# EAGLE design schematics (EAGLE 9.4.2)
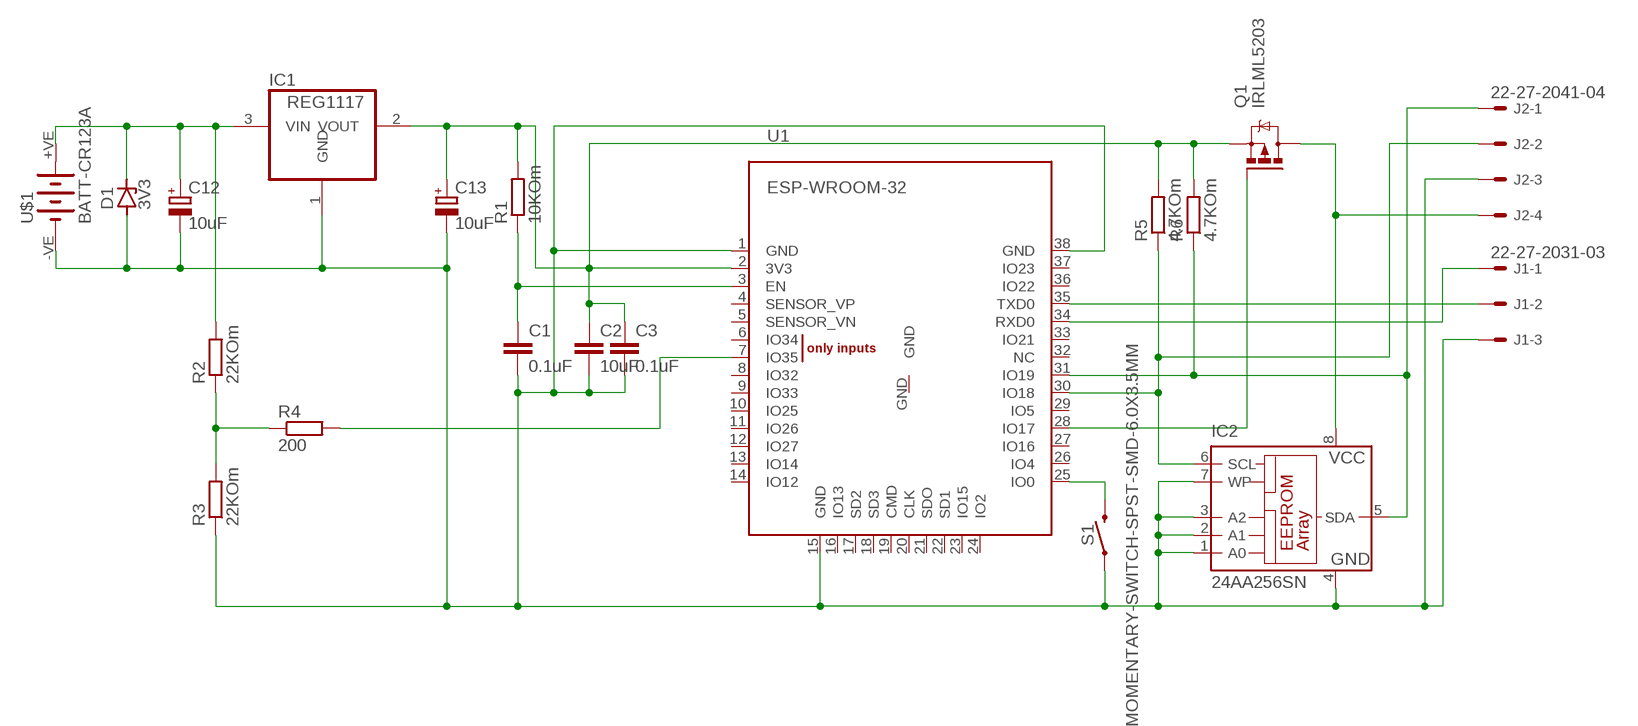
[diagram p0: schematic, sheet 1]

## Parts
C1  0.1uF  C-EUC1206K  [C1206K]
C2  10uF  C-EUC1206K  [C1206K]
C3  0.1uF  C-EUC1206K  [C1206K]
C12  10uF  CPOL-EUSMCE  [SMC_E]
C13  10uF  CPOL-EUSMCE  [SMC_E]
D1  3V3  ZENER-DIODESOT223  [SOT223]
IC1  REG1117  [SOT223]
IC2  24AA256SN  [SO-08]
J1  22-27-2031-03  [6410-03]
J2  22-27-2041-04  [6410-04]
Q1  IRLML5203  [MICRO3]
R1  10KOm  R-EU_R1206  [R1206]
R2  22KOm  R-EU_R1206  [R1206]
R3  22KOm  R-EU_R1206  [R1206]
R4  200  R-EU_R1206  [R1206]
R5  4.7KOm  R-EU_R1206  [R1206]
R6  4.7KOm  R-EU_R1206  [R1206]
S1  MOMENTARY-SWITCH-SPST-SMD-6.0X3.5MM  [TACTILE_SWITCH_SMD_6.0X3.5MM]
U1  ESP-WROOM-32  [ESP-WROOM-32]
U$1  BATT-CR123A  [KEYSTONE-2/3A]

## Nets
N$2: C12.+ D1.4(C) IC1.3(VIN) R2.2 U$1.+VE(+)
N$3: S1.2 U1.25(IO0)
N$4: R2.1 R3.2 R4.1
N$5: C1.2 C2.2 C3.2 C12.- C13.- D1.1(A) IC1.1(GND) IC2.1(A0) IC2.2(A1) IC2.3(A2) IC2.4(GND) IC2.7(WP) J1.3 J2.3 R3.1 S1.1 U1.1(GND) U1.15(GND) U1.38(GND) U$1.-VE(-)
N$6: C1.1 R1.1 U1.3(EN)
N$7: J1.2 U1.35(TXD0)
N$8: C2.1 C3.1 C13.+ IC1.2(VOUT) Q1.2(S) R1.2 R5.2 R6.2 U1.2(3V3)
N$9: R4.2 U1.7(IO35)
N$10: J1.1 U1.34(RXD0)
N$11: IC2.6(SCL) J2.2 R5.1 U1.30(IO18)
N$12: IC2.5(SDA) J2.1 R6.1 U1.31(IO19)
N$13: Q1.1(G) U1.28(IO17)
N$16: IC2.8(VCC) J2.4 Q1.3(D)
Unconnected: U1.4(SENSOR_VP) U1.5(SENSOR_VN) U1.6(IO34) U1.8(IO32) U1.9(IO33) U1.10(IO25) U1.11(IO26) U1.12(IO27) U1.13(IO14) U1.14(IO12) U1.16(IO13) U1.17(SD2) U1.18(SD3) U1.19(CMD) U1.20(CLK) U1.21(SDO) U1.22(SD1) U1.23(IO15) U1.24(IO2) U1.26(IO4) U1.27(IO16) U1.29(IO5) U1.32(NC) U1.33(IO21) U1.36(IO22) U1.37(IO23) U1.GND

## Library data of the parts
C1-C3 = rcl:C-EU: CAPACITOR, European symbol; SPICEPREFIX: C
C12 C13 = rcl:CPOL-EU: POLARIZED CAPACITOR, European symbol; SPICEPREFIX: C
D1 = diode:ZENER-DIODE: Z-Diode
IC1 = burr-brown:REG1117: 800mA and 1A Low Dropout (LDO) Positive Regulator 1.8V, 2.5V, 2.85V, 3.3V, 5V, and Adj; MPN: REG1117; OC_FARNELL: 1097566; OC_NEWARK: 14P6981
IC2 = microchip:24*: Serial EEPROM I2C; MPN: 24AA256T-I/SM; OC_FARNELL: 1579570; OC_NEWARK: 08N6838
J1 = con-molex:22-?-03: CONNECTOR wire to board 2.54 mm (.1 inch) pitch header; MF: MOLEX; OC_FARNELL: unknown; OC_NEWARK: unknown
J2 = con-molex:22-?-04: CONNECTOR wire to board 2.54 mm (.1 inch) pitch header; MF: MOLEX; OC_FARNELL: unknown; OC_NEWARK: unknown
Q1 = transistor-power:IRLML5203: HEXFET P-Channel Power MOSFET
R1-R6 = rcl:R-EU_: RESISTOR, European symbol; SPICEPREFIX: R
S1 = SparkFun-Switches:MOMENTARY-SWITCH-SPST: Momentary Switch (Pushbutton) - SPST Normally-open (NO) SPST momentary switches (buttons, pushbuttons). Variants PTH-12MM - 12mm square, through-hole Momentary Pushbutton Switch - 12mm Square <https://www.sparkfun.com/products/9190> (COM-09190) PTH-6.0MM, PTH-6.0MM-KIT - 6.0mm square, through-hole Mini Pushbutton Switch <https://www.sparkfun.com/products/97> (COM-00097) KIT package intended for soldering kit's - only one side of pads' copper is exposed. PTH-RIGHT-ANGLE-KIT - Right-angle, through-hole Right Angle Tactile Button <https://www.sparkfun.com/products/10791> - Used on SparkFun BigTime Watch Kit <https://www.sparkfun.com/products/11734> SMD-12MM - 12mm square, surface-mount Tactile Button - SMD (12mm) <https://www.sparkfun.com/products/12993> (COM-12993) Used on SparkFun PicoBoard <https://www.sparkfun.com/products/11888> SMD-4.5MM - 4.5mm Square Trackball Switch Used on SparkFun Blackberry Trackballer Breakout <https://www.sparkfun.com/products/13169> SMD-4.6MMX2.8MM - 4.60mm x 2.80mm, surface mount Used on SparkFun SAMD21 Mini Breakout <https://www.sparkfun.com/products/13664> SMD-5.2MM, SMD-5.2-REDUNDANT - 5.2mm square, surface-mount Mini Pushbutton Switch - SMD <https://www.sparkfun.com/products/8720> (COM-08720) Used on Arduino Pro Mini <https://www.sparkfun.com/products/11114> REDUNDANT package connects both switch circuits together SMD-6.0X3.5MM - 6.0 x 3.5mm, surface mount Momentary Reset Switch SMD <https://www.sparkfun.com/products/8229> (COM-08229) SMD-6.2MM-TALL - 6.2mm square, surface mount Tactile Button - SMD (6mm) <https://www.sparkfun.com/products/12992> Used on SparkFun Digital Sandbox <https://www.sparkfun.com/products/12651> SMD-RIGHT-ANGLE - Right-angle, surface mount Used on SparkFun Block for Intel® Edison - Arduino <https://www.sparkfun.com/products/13036>; PROD_ID: SWCH-14278; SF_SKU: COM-08229
U1 = esp32:ESP-WROOM-32
U$1 = eagle-library-edeca.net-v5:BATT-CR123A: CR123A (2/3rd AA) battery holder Manufacturer: Keystone Mouser part: 534-1019

## Net classes
0 default: width 0.813 mm

## Board
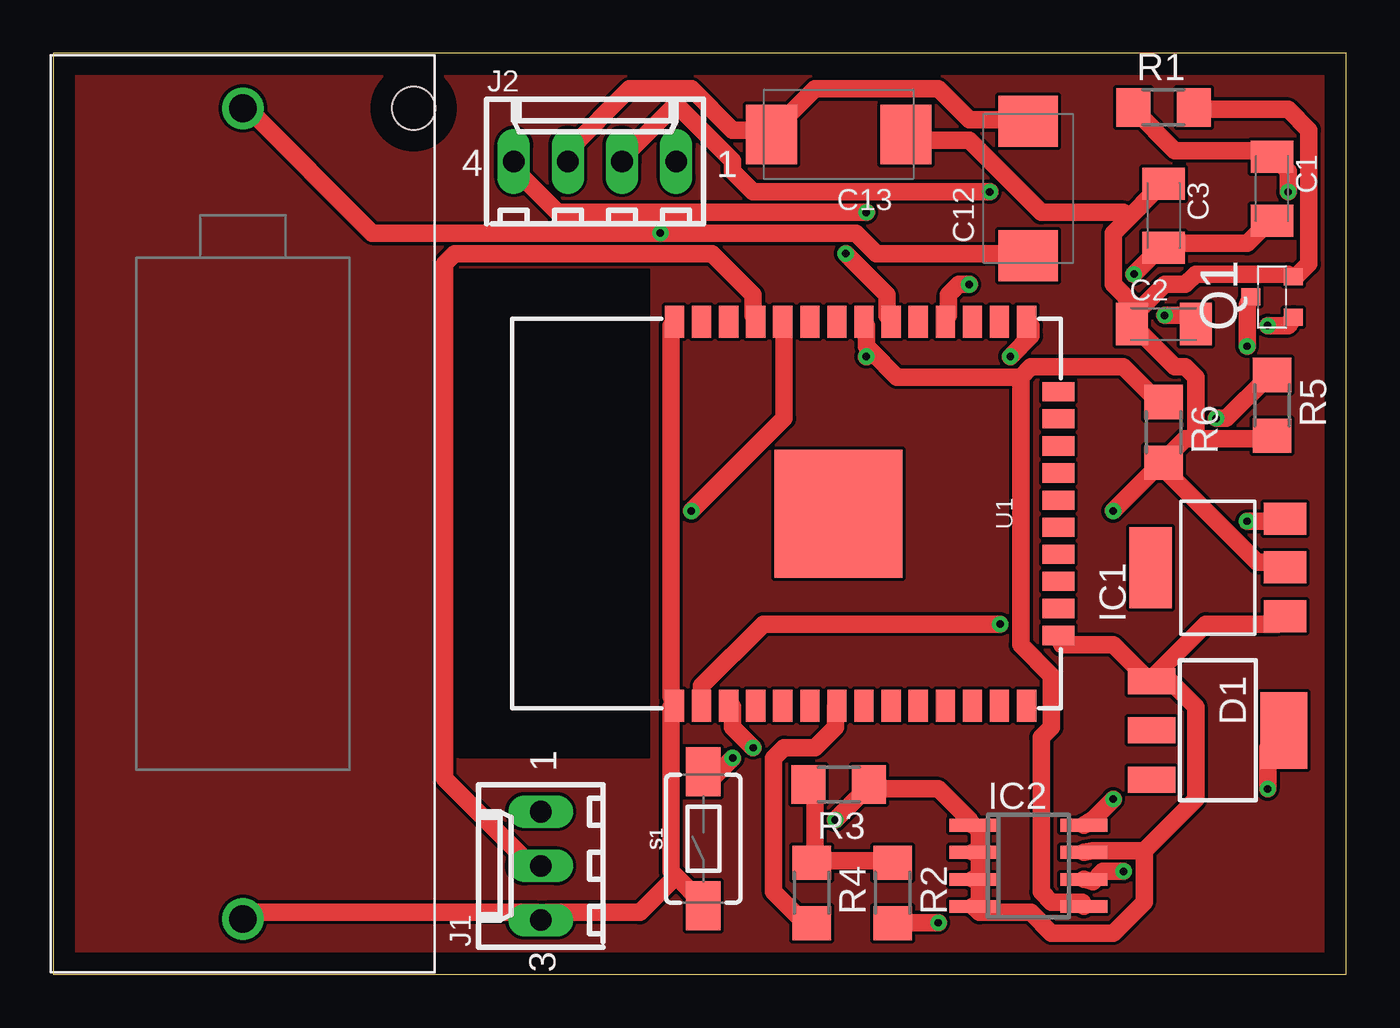
[diagram p1: board, top side]
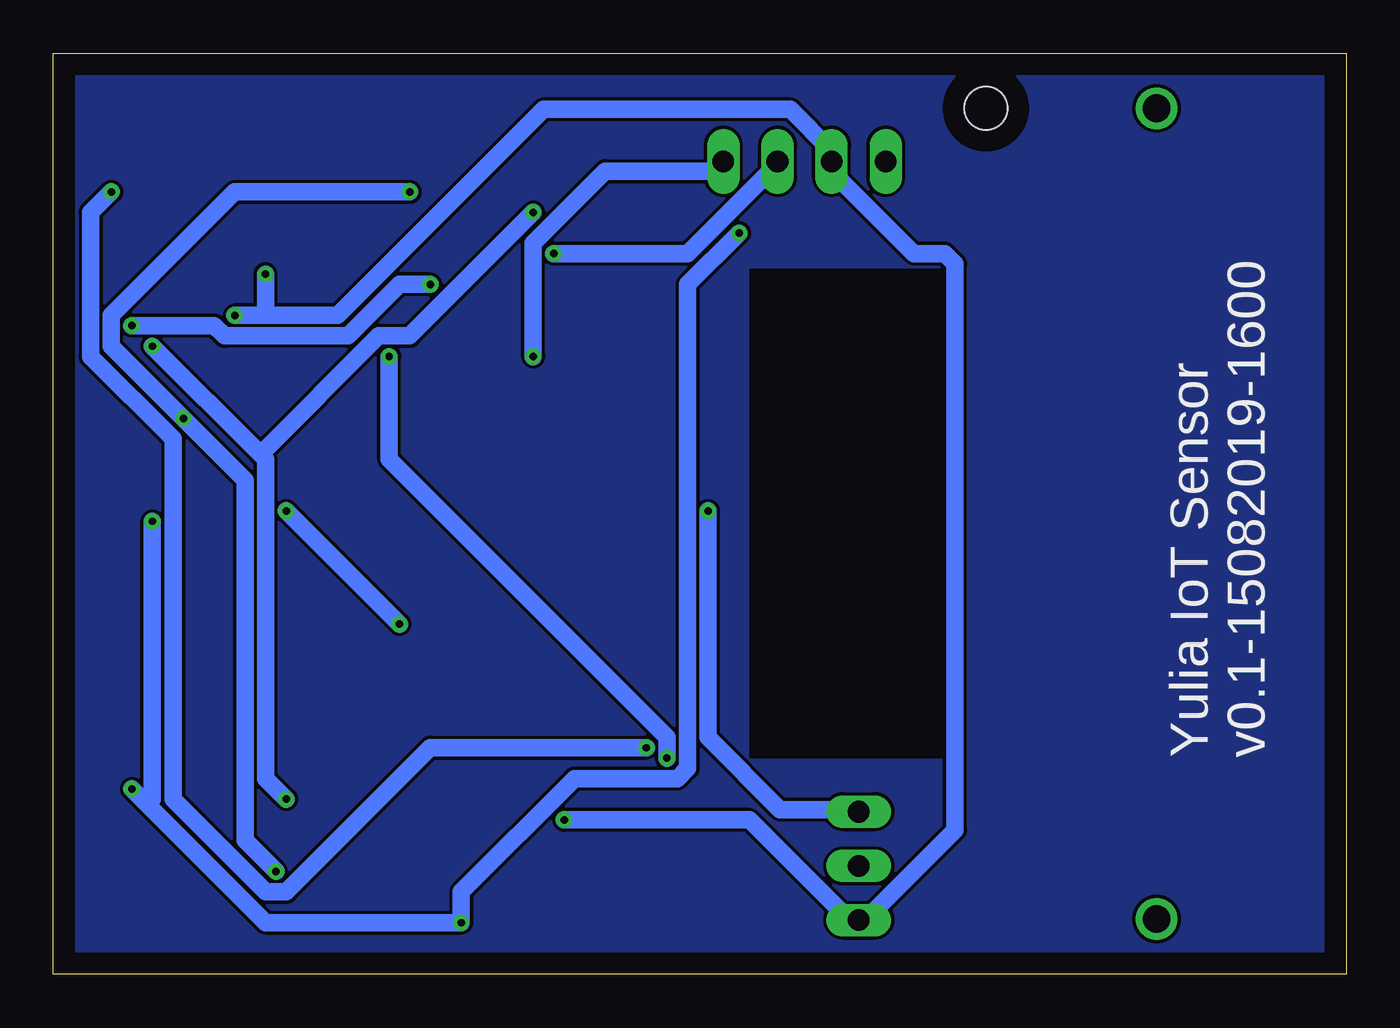
[diagram p2: board, bottom side, seen from below]

Size 60.63 x 43.17 mm. Coordinates in mm from the lower left corner, seen from the top.
Outline: 0,0 60.63,0 60.63,43.17 0,43.17 0,0
Copper layers (1*16): Top 0.035mm / dielectric 1.5mm / Bottom 0.035mm
Design rules "default": minimum track width 6mil, minimum drill 0.35mm, track to track 6mil, track to pad 6mil, pad to pad 6mil, via to via 6mil, smd to smd 6mil, copper to edge 40mil, drill to drill 6mil, minimum pad ring 10mil, minimum via ring 8mil, stop-mask expansion 4mil, vias tented up to drill 0mil, thermal gap 10mil

### Footprints (pad centres in the part's own frame; a part is rotated, then mirrored left to right if it is on the bottom)
C1206K = smd 1.5 x 2: 1 -1.5,0; 2 1.5,0
SMC_E = smd 2.4 x 2.8: + -3.15,0; - 3.15,0
SOT223 = smd 1.219 x 2.235: 1 -2.311,-3.099; 2 0,-3.099; 3 2.311,-3.099 | smd 3.6 x 2.2: 4 0,3.099
SOT223' = smd 1.499 x 2.007: 1 -2.261,-3.15; 2 0.025,-3.15; 3 2.311,-3.15 | smd 3.81 x 2.007: 4 0,3.15
SO-08 = smd 0.6 x 2.2: 1 -1.905,-2.6; 2 -0.635,-2.6; 3 0.635,-2.6; 4 1.905,-2.6; 5 1.905,2.6; 6 0.635,2.6; 7 -0.635,2.6; 8 -1.905,2.6
6410-03 = drill 1.016 long: 1 2.54,0; 2 0,0; 3 -2.54,0
6410-04 = drill 1.016 long: 1 3.81,0; 2 1.27,0; 3 -1.27,0; 4 -3.81,0
MICRO3 = smd 0.8 x 0.9: 1 -0.95,-1; 2 0.95,-1; 3 0,1
R1206 = smd 1.6 x 1.803: 1 -1.422,0; 2 1.422,0
TACTILE_SWITCH_SMD_6.0X3.5MM = smd 2.3 x 1.6: 1 -3.15,0; 2 3.15,0
ESP-WROOM-32 = smd 0.9 x 1.5: 1 7.7,9; 2 6.43,9; 3 5.16,9; 4 3.89,9; 5 2.62,9; 6 1.35,9; 7 0.08,9; 8 -1.19,9; 9 -2.46,9; 10 -3.73,9; 11 -5,9; 12 -6.27,9; 13 -7.54,9; 14 -8.81,9; 25 -8.81,-9; 26 -7.54,-9; 27 -6.27,-9; 28 -5,-9; 29 -3.73,-9; 30 -2.46,-9; 31 -1.19,-9; 32 0.08,-9; 33 1.35,-9; 34 2.62,-9; 35 3.89,-9; 36 5.16,-9; 37 6.43,-9; 38 7.7,-9 | smd 1.5 x 0.9: 15 -10.3,5.715; 16 -10.3,4.445; 17 -10.3,3.175; 18 -10.3,1.905; 19 -10.3,0.635; 20 -10.3,-0.635; 21 -10.3,-1.905; 22 -10.3,-3.175; 23 -10.3,-4.445; 24 -10.3,-5.715 | smd 6 x 6: GND 0,0
KEYSTONE-2/3A = drill 1.3: +VE 0,19; -VE 0,-19 | hole 2: 8,19

### Placement (x,y rotation side)
C1  57.15,36.83 270 top
C2  52.07,30.48 0 top
C3  52.07,35.56 270 top
C12  45.72,36.83 90 top
C13  36.83,39.37 180 top
D1  54.61,11.43 270 top
IC1  REG1117  [SOT223']  54.61,19.05 90 top
IC2  45.72,5.08 270 top
J1  22.86,5.08 90 top
J2  25.4,38.1 0 top
Q1  57.15,31.75 90 top
R1  52.07,40.64 0 top
R2  39.37,3.81 270 top
R3  36.83,8.89 180 top
R4  35.56,3.81 270 top
R5  57.15,26.67 270 top
R6  52.07,25.4 270 top
S1  30.48,6.35 90 top
U1  36.83,21.59 180 top
U$1  8.89,21.59 0 top

### Tracks (layer width: path | path; a pad name or v marks a point on that pad's centre or on a via)
GND
  pour Top: 0,43.18 60.96,43.18 60.96,0 0,0
  pour Bottom: 0,43.18 60.96,43.18 60.96,0 0,0
N$2  (via drill 0.35)
  Top 0.813: v41.5,2.41 39.57,2.41 R2.2 | v56.95,8.69 56.95,10.62 57.43,11.1 D1.4 | v55.98,21.23 57.43,21.23 IC1.3 | C12.+ 45.36,33.78 38.61,33.78 37.64,34.75 v28.47,34.75 14.96,34.75 9.17,40.54 U$1.+VE
  Bottom 0.813: v56.95,8.69 56.22,7.96 | 56.22,7.96 50.67,2.41 v41.5,2.41 41.5,3.86 36.2,9.17 31.37,9.17 30.89,9.65 30.89,32.33 v28.47,34.75 | v55.98,21.23 55.98,8.2 56.22,7.96
N$3  (via drill 0.35)
  Top 0.813: v44.88,28.96 45.85,29.92 45.85,30.4 U1.25 | v31.85,10.13 30.89,9.17 S1.2
  Bottom 0.813: v44.88,28.96 44.88,24.13 31.85,11.1 v31.85,10.13
N$4
  Top 0.813: 35.71,5.31 35.71,8.69 R3.2 | 35.71,5.31 39.09,5.31 R2.1 | 35.71,5.31 R4.1
N$5  (via drill 0.35)
  Top 0.813: C1.2 56.95,35.23 55.98,34.27 52.12,34.27 C3.2 51.64,33.78 v50.67,32.82 | v52.12,30.89 53.57,30.89 C2.2 | J2.3 24.13,38.61 27.03,41.5 29.92,41.5 31.85,39.57 33.3,39.57 C13.- 33.78,39.57 35.71,41.5 41.5,41.5 42.95,40.06 45.36,40.06 C12.- | 43.43,4.34 43.43,3.38 IC2.4 43.43,2.9 45.85,2.9 46.81,1.93 49.71,1.93 51.16,3.38 51.16,5.79 | 43.43,5.79 43.43,6.76 IC2.1 42.95,7.24 41.5,8.69 38.61,8.69 R3.1 38.12,8.69 v36.68,7.24 | 43.43,5.79 43.43,4.34 | 43.43,4.34 IC2.3 | 43.43,5.79 IC2.2 | U1.15 47.3,15.44 49.71,15.44 51.16,13.99 D1.1 | IC1.1 57.43,16.41 54.05,16.41 51.64,13.99 D1.1 | 51.16,5.79 48.74,5.79 IC2.7 | 51.16,5.79 53.57,8.2 53.57,12.55 52.12,13.99 D1.1 | 29.2,4.58 30.4,3.38 S1.1 | 29.2,4.58 28.96,4.83 28.96,12.55 U1.1 28.96,13.03 28.96,30.4 U1.38 | 29.2,4.58 27.51,2.9 23.16,2.9 J1.3 22.68,2.9 9.17,2.9 U$1.-VE
  Bottom 0.813: 50.67,30.89 47.3,30.89 37.64,40.54 26.06,40.54 24.13,38.61 J2.3 24.13,37.64 20.27,33.78 18.82,33.78 18.34,33.3 18.34,6.76 22.68,2.41 J1.3 23.16,2.41 27.99,7.24 v36.68,7.24 | 50.67,30.89 v52.12,30.89 | 50.67,30.89 v50.67,32.82
N$6  (via drill 0.35)
  Top 0.813: v32.82,10.62 31.85,11.58 31.85,12.55 U1.3 | v57.91,36.68 57.91,37.64 57.43,38.12 C1.1 56.95,38.61 52.6,38.61 50.67,40.54 R1.1
  Bottom 0.813: v32.82,10.62 42.95,10.62 49.71,3.86 50.67,3.86 55.02,8.2 55.02,25.09 58.88,28.96 58.88,35.71 v57.91,36.68
N$7
  Top 0.813: U1.35 32.82,30.89 32.82,31.85 30.89,33.78 18.82,33.78 18.34,33.3 18.34,9.17 22.68,4.83 J1.2
N$8  (via drill 0.35)
  Top 0.813: C2.1 50.67,30.89 52.12,32.33 53.09,32.33 53.57,32.82 57.91,32.82 Q1.2 58.4,32.82 58.88,33.3 58.88,39.57 57.91,40.54 53.57,40.54 R1.2 | 50.43,35.47 49.71,34.75 49.71,32.33 50.67,31.37 C2.1 | 50.43,35.47 51.64,36.68 C3.1 | C13.+ 40.06,39.09 42.95,39.09 46.33,35.71 50.19,35.71 50.43,35.47 | v44.4,16.41 33.3,16.41 30.4,13.51 30.4,13.03 U1.2 | v49.71,21.72 51.64,23.65 R6.2 | 53.57,25.09 53.09,25.09 52.12,24.13 R6.2 | 53.57,25.09 56.95,25.09 R5.2 | IC1.2 57.43,19.3 56.46,19.3 52.12,23.65 R6.2 | 53.57,25.09 53.57,27.99 53.09,28.47 52.6,28.47 50.67,30.4 C2.1
  Bottom 0.813: v49.71,21.72 v44.4,16.41
N$9
  Top 0.813: U1.7 36.68,12.55 36.68,11.58 35.71,10.62 34.27,10.62 33.78,10.13 33.78,3.86 35.23,2.41 R4.2
N$10  (via drill 0.35)
  Top 0.813: v29.92,21.72 34.27,26.06 34.27,30.4 U1.34
  Bottom 0.813: v29.92,21.72 29.92,11.1 26.54,7.72 23.16,7.72 J1.1
N$11  (via drill 0.35)
  Top 0.813: v37.16,33.78 39.09,31.85 39.09,30.89 U1.30 | v54.53,26.06 55.02,26.06 56.95,27.99 R5.1 | v50.19,4.83 49.23,4.83 48.74,4.34 IC2.6 | v43.92,36.68 32.82,36.68 31.85,37.64 31.85,38.12 29.44,40.54 28.96,40.54 27.03,38.61 27.03,38.12 J2.2
  Bottom 0.813: v37.16,33.78 30.89,33.78 27.03,37.64 J2.2 | v50.19,4.83 51.64,6.27 51.64,23.16 v54.53,26.06 57.91,29.44 57.91,30.89 52.12,36.68 v43.92,36.68
N$12  (via drill 0.35)
  Top 0.813: 38.37,29.2 39.57,27.99 45.36,27.99 | 38.37,29.2 38.12,29.44 38.12,30.4 U1.31 | 45.36,27.99 45.85,28.47 50.19,28.47 51.64,27.03 R6.1 | 45.36,27.99 45.36,15.44 46.81,13.99 46.81,11.58 46.33,11.1 46.33,3.86 46.81,3.38 48.26,3.38 IC2.5 | v38.12,28.96 38.37,29.2
  Bottom 0.813: v38.12,28.96 38.12,34.27 34.75,37.64 29.44,37.64 J2.1
N$13  (via drill 0.35)
  Top 0.813: v56.95,30.4 57.91,30.4 Q1.1 | v42.95,32.33 42.47,32.33 41.99,31.85 41.99,30.89 U1.28
  Bottom 0.813: v56.95,30.4 53.09,30.4 52.6,29.92 46.81,29.92 44.4,32.33 v42.95,32.33
N$16  (via drill 0.35)
  Top 0.813: v55.98,29.44 55.98,31.37 Q1.3 | v49.71,8.2 48.74,7.24 IC2.8 | v38.12,35.71 23.65,35.71 21.72,37.64 J2.4
  Bottom 0.813: 50.91,24.37 50.67,24.13 50.67,9.17 v49.71,8.2 | 50.91,24.37 v55.98,29.44 | v38.12,35.71 43.92,29.92 45.36,29.92 50.91,24.37

### Text on the board
bNames: Yulia IoT Sensor / v0.1-15082019-1600